# EAGLE design M900proto (EAGLE 6.6.0)
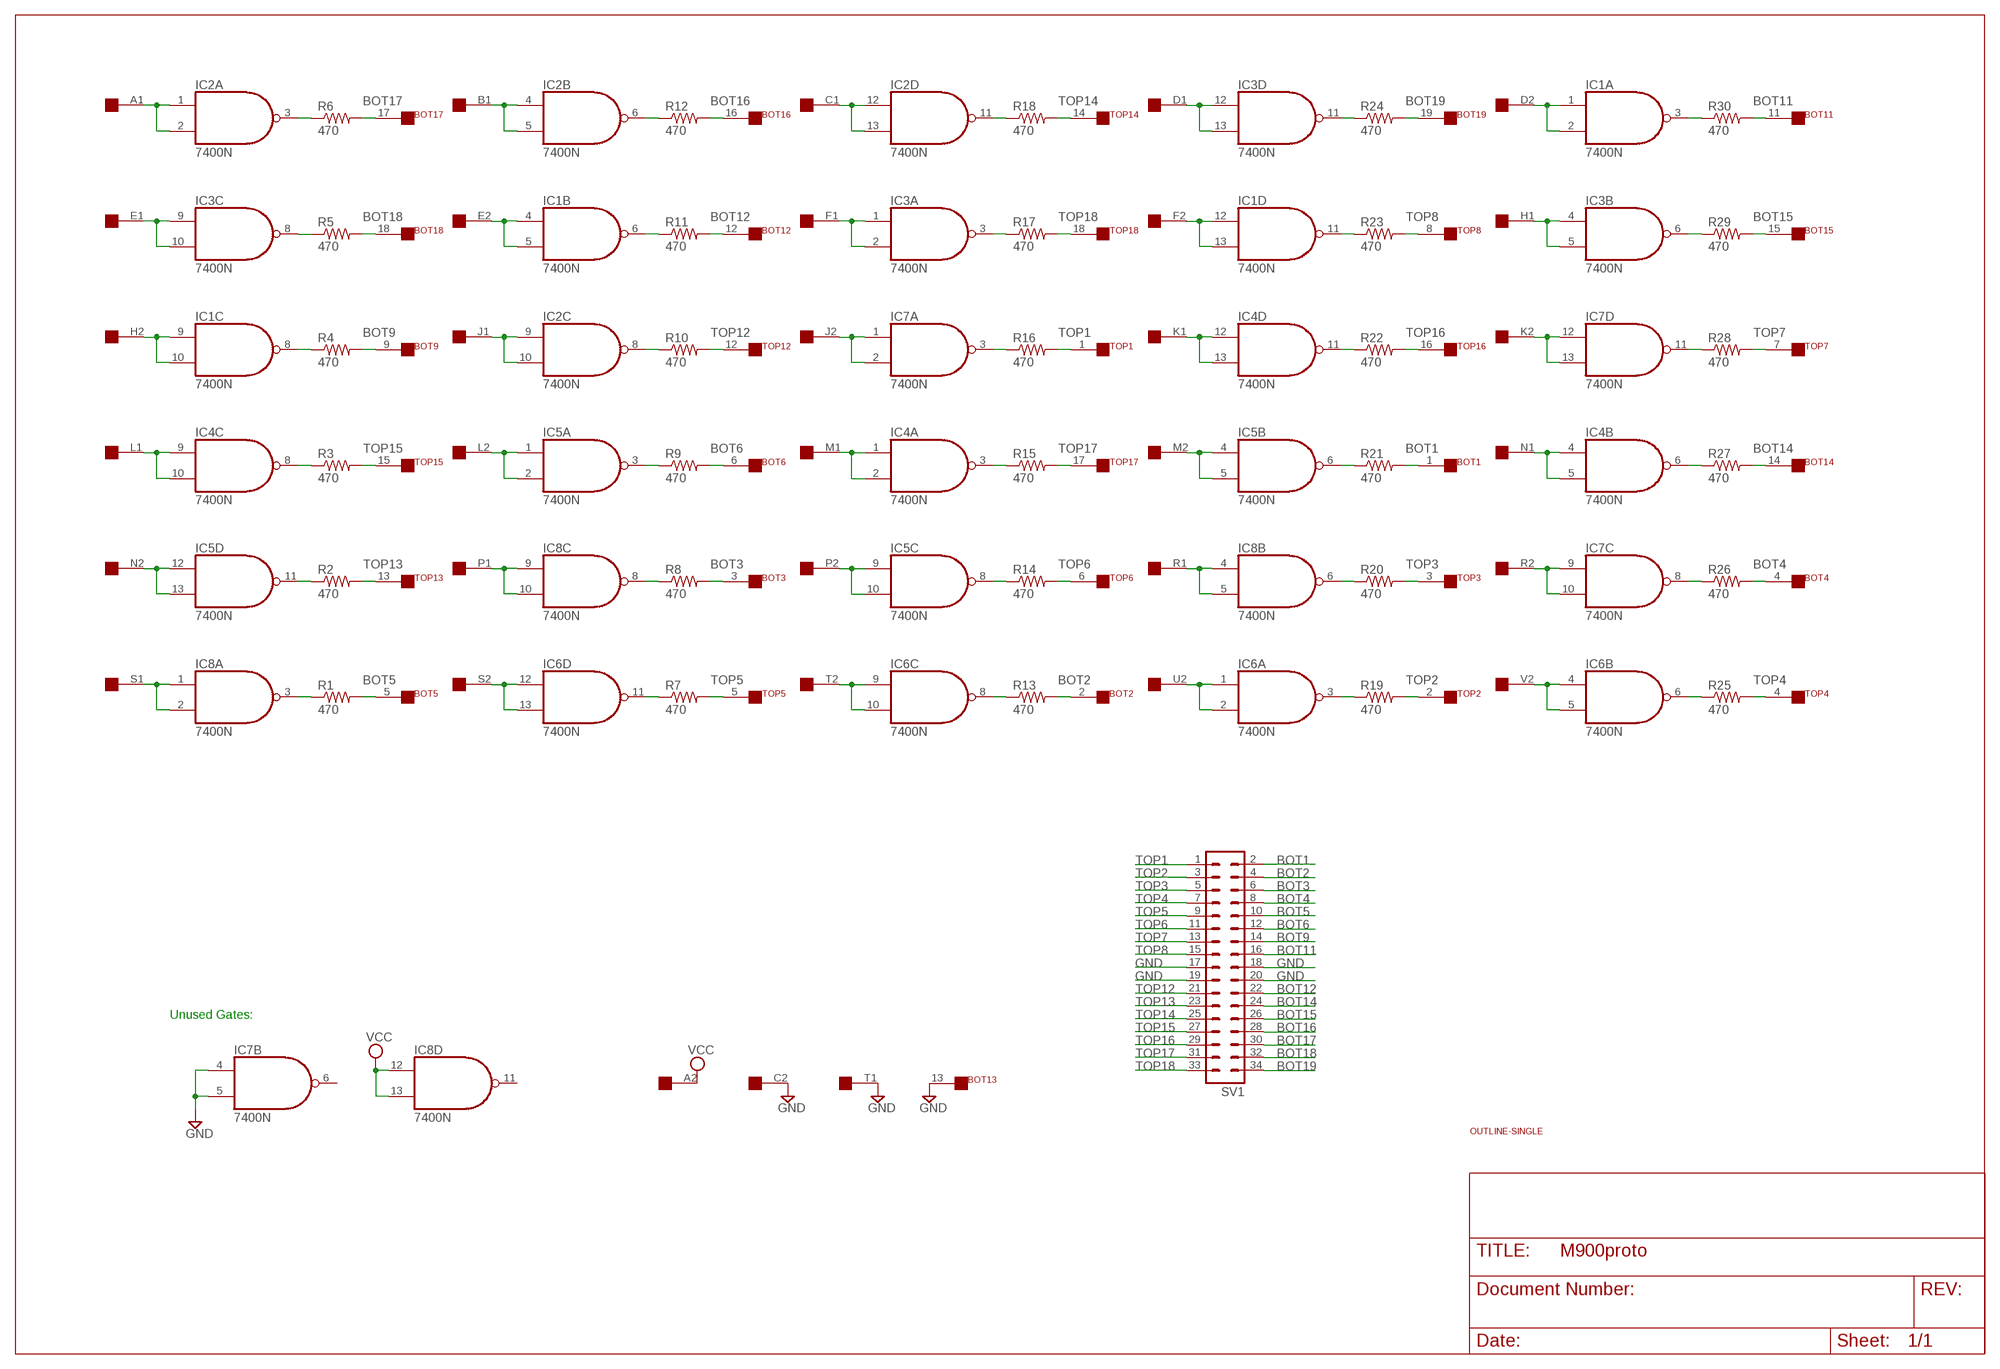
[diagram p0: schematic, sheet 1]

## Parts
BOT  FLEX19  [FLEX19]
EDGE  SINGLE  [EDGE-CON2]
IC1  7400N  [DIL14]
IC2  7400N  [DIL14]
IC3  7400N  [DIL14]
IC4  7400N  [DIL14]
IC5  7400N  [DIL14]
IC6  7400N  [DIL14]
IC7  7400N  [DIL14]
IC8  7400N  [DIL14]
R1  470  R-US_0207/10  [0207/10]
R2  470  R-US_0207/10  [0207/10]
R3  470  R-US_0207/10  [0207/10]
R4  470  R-US_0207/10  [0207/10]
R5  470  R-US_0207/10  [0207/10]
R6  470  R-US_0207/10  [0207/10]
R7  470  R-US_0207/10  [0207/10]
R8  470  R-US_0207/10  [0207/10]
R9  470  R-US_0207/10  [0207/10]
R10  470  R-US_0207/10  [0207/10]
R11  470  R-US_0207/10  [0207/10]
R12  470  R-US_0207/10  [0207/10]
R13  470  R-US_0207/10  [0207/10]
R14  470  R-US_0207/10  [0207/10]
R15  470  R-US_0207/10  [0207/10]
R16  470  R-US_0207/10  [0207/10]
R17  470  R-US_0207/10  [0207/10]
R18  470  R-US_0207/10  [0207/10]
R19  470  R-US_0207/10  [0207/10]
R20  470  R-US_0207/10  [0207/10]
R21  470  R-US_0207/10  [0207/10]
R22  470  R-US_0207/10  [0207/10]
R23  470  R-US_0207/10  [0207/10]
R24  470  R-US_0207/10  [0207/10]
R25  470  R-US_0207/10  [0207/10]
R26  470  R-US_0207/10  [0207/10]
R27  470  R-US_0207/10  [0207/10]
R28  470  R-US_0207/10  [0207/10]
R29  470  R-US_0207/10  [0207/10]
R30  470  R-US_0207/10  [0207/10]
SV1  MA17-2  [MA17-2]
TOP  FLEX19  [FLEX19]
U$2  OUTLINE-SINGLE  [SINGLE]

## Nets
BOT1: BOT.1 R21.2 SV1.2
BOT2: BOT.2 R13.2 SV1.4
BOT3: BOT.3 R8.2 SV1.6
BOT4: BOT.4 R26.2 SV1.8
BOT5: BOT.5 R1.2 SV1.10
BOT6: BOT.6 R9.2 SV1.12
BOT9: BOT.9 R4.2 SV1.14
BOT11: BOT.11 R30.2 SV1.16
BOT12: BOT.12 R11.2 SV1.22
BOT14: BOT.14 R27.2 SV1.24
BOT15: BOT.15 R29.2 SV1.26
BOT16: BOT.16 R12.2 SV1.28
BOT17: BOT.17 R6.2 SV1.30
BOT18: BOT.18 R5.2 SV1.32
BOT19: BOT.19 R24.2 SV1.34
GND [supply]: BOT.13 EDGE.C2 EDGE.T1 IC7.4(B:I0) IC7.5(B:I1) SV1.17 SV1.18 SV1.19 SV1.20
N$1: EDGE.A1 IC2.1(A:I0) IC2.2(A:I1)
N$2: IC2.3(A:O) R6.1
N$3: IC3.8(C:O) R5.1
N$4: IC1.8(C:O) R4.1
N$5: IC4.8(C:O) R3.1
N$6: IC5.11(D:O) R2.1
N$7: EDGE.H2 IC1.9(C:I0) IC1.10(C:I1)
N$8: EDGE.S1 IC8.1(A:I0) IC8.2(A:I1)
N$9: EDGE.N2 IC5.12(D:I0) IC5.13(D:I1)
N$10: EDGE.L1 IC4.9(C:I0) IC4.10(C:I1)
N$11: EDGE.E1 IC3.9(C:I0) IC3.10(C:I1)
N$12: EDGE.P1 IC8.9(C:I0) IC8.10(C:I1)
N$13: EDGE.B1 IC2.4(B:I0) IC2.5(B:I1)
N$14: EDGE.E2 IC1.4(B:I0) IC1.5(B:I1)
N$15: EDGE.J1 IC2.9(C:I0) IC2.10(C:I1)
N$16: EDGE.L2 IC5.1(A:I0) IC5.2(A:I1)
N$17: EDGE.S2 IC6.12(D:I0) IC6.13(D:I1)
N$18: IC8.8(C:O) R8.1
N$19: IC5.3(A:O) R9.1
N$20: IC2.8(C:O) R10.1
N$21: IC1.6(B:O) R11.1
N$22: IC2.6(B:O) R12.1
N$23: IC6.11(D:O) R7.1
N$24: IC8.3(A:O) R1.1
N$25: EDGE.P2 IC5.9(C:I0) IC5.10(C:I1)
N$26: EDGE.C1 IC2.12(D:I0) IC2.13(D:I1)
N$27: EDGE.F1 IC3.1(A:I0) IC3.2(A:I1)
N$28: EDGE.J2 IC7.1(A:I0) IC7.2(A:I1)
N$29: EDGE.M1 IC4.1(A:I0) IC4.2(A:I1)
N$30: EDGE.T2 IC6.9(C:I0) IC6.10(C:I1)
N$31: IC6.8(C:O) R13.1
N$32: IC5.8(C:O) R14.1
N$33: IC4.3(A:O) R15.1
N$34: IC7.3(A:O) R16.1
N$35: IC2.11(D:O) R18.1
N$36: IC3.3(A:O) R17.1
N$37: IC6.3(A:O) R19.1
N$38: IC8.6(B:O) R20.1
N$39: IC5.6(B:O) R21.1
N$40: IC4.11(D:O) R22.1
N$41: IC1.11(D:O) R23.1
N$42: IC3.11(D:O) R24.1
N$43: EDGE.R1 IC8.4(B:I0) IC8.5(B:I1)
N$44: EDGE.F2 IC1.12(D:I0) IC1.13(D:I1)
N$45: EDGE.K1 IC4.12(D:I0) IC4.13(D:I1)
N$46: EDGE.M2 IC5.4(B:I0) IC5.5(B:I1)
N$47: EDGE.U2 IC6.1(A:I0) IC6.2(A:I1)
N$48: EDGE.R2 IC7.9(C:I0) IC7.10(C:I1)
N$49: EDGE.D1 IC3.12(D:I0) IC3.13(D:I1)
N$50: EDGE.D2 IC1.1(A:I0) IC1.2(A:I1)
N$51: EDGE.H1 IC3.4(B:I0) IC3.5(B:I1)
N$52: EDGE.K2 IC7.12(D:I0) IC7.13(D:I1)
N$53: EDGE.N1 IC4.4(B:I0) IC4.5(B:I1)
N$54: EDGE.V2 IC6.4(B:I0) IC6.5(B:I1)
N$55: IC6.6(B:O) R25.1
N$56: IC7.8(C:O) R26.1
N$57: IC4.6(B:O) R27.1
N$58: IC7.11(D:O) R28.1
N$59: IC3.6(B:O) R29.1
N$60: IC1.3(A:O) R30.1
TOP1: R16.2 SV1.1 TOP.1
TOP2: R19.2 SV1.3 TOP.2
TOP3: R20.2 SV1.5 TOP.3
TOP4: R25.2 SV1.7 TOP.4
TOP5: R7.2 SV1.9 TOP.5
TOP6: R14.2 SV1.11 TOP.6
TOP7: R28.2 SV1.13 TOP.7
TOP8: R23.2 SV1.15 TOP.8
TOP12: R10.2 SV1.21 TOP.12
TOP13: R2.2 SV1.23 TOP.13
TOP14: R18.2 SV1.25 TOP.14
TOP15: R3.2 SV1.27 TOP.15
TOP16: R22.2 SV1.29 TOP.16
TOP17: R15.2 SV1.31 TOP.17
TOP18: R17.2 SV1.33 TOP.18
VCC [supply]: EDGE.A2 IC8.12(D:I0) IC8.13(D:I1)
Unconnected: BOT.7 BOT.8 BOT.10 EDGE.B2 EDGE.U1 EDGE.V1 IC7.6(B:O) IC8.11(D:O) TOP.9 TOP.10 TOP.11 TOP.19

## Notes on the sheet
- Unused Gates:

## Power pins joined to a net without a drawn wire
GND: IC1.7(P:GND) IC2.7(P:GND) IC3.7(P:GND) IC4.7(P:GND) IC5.7(P:GND) IC6.7(P:GND) IC7.7(P:GND) IC8.7(P:GND)
VCC: IC1.14(P:VCC) IC2.14(P:VCC) IC3.14(P:VCC) IC4.14(P:VCC) IC5.14(P:VCC) IC6.14(P:VCC) IC7.14(P:VCC) IC8.14(P:VCC)

## Library data of the parts
BOT TOP = dec-con:FLEX19: 19 pin Flexprint Connection
EDGE = dec-con:SINGLE: Single-Height DEC board
IC1-IC8 = 74xx-us:74*00: Quad 2-input NAND gate
R1-R30 = rcl:R-US_: RESISTOR, American symbol
SV1 = con-lstb:MA17-2: PIN HEADER; OC_FARNELL: unknown; OC_NEWARK: unknown
U$2 = dec-con:OUTLINE-*: Board outlines for DEC boards.

## Net classes
0 default: width 0.381 mm
1 supply: width 0.762 mm

## Board
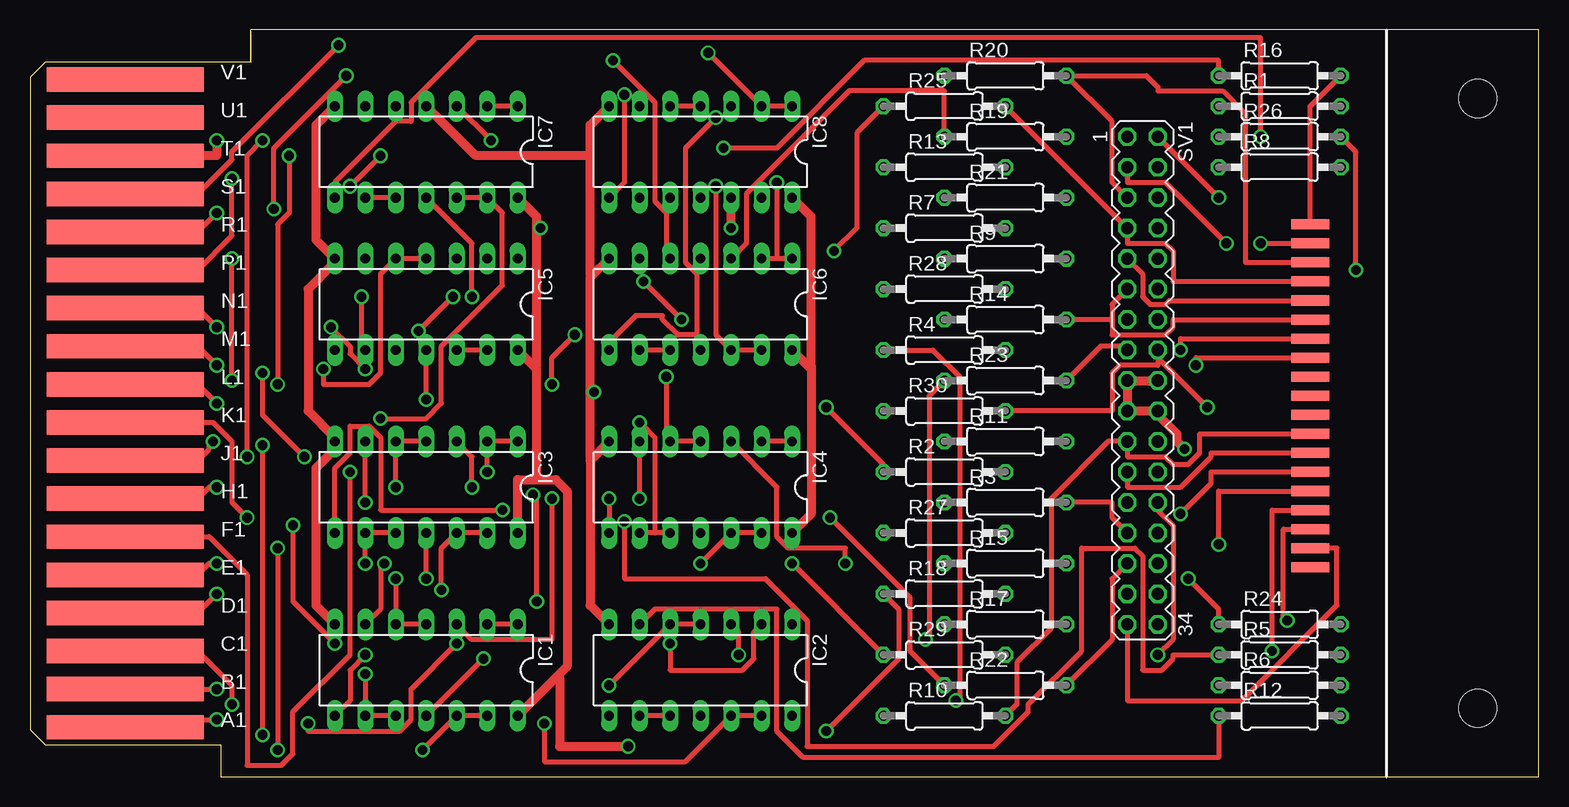
[diagram p1: board, top side]
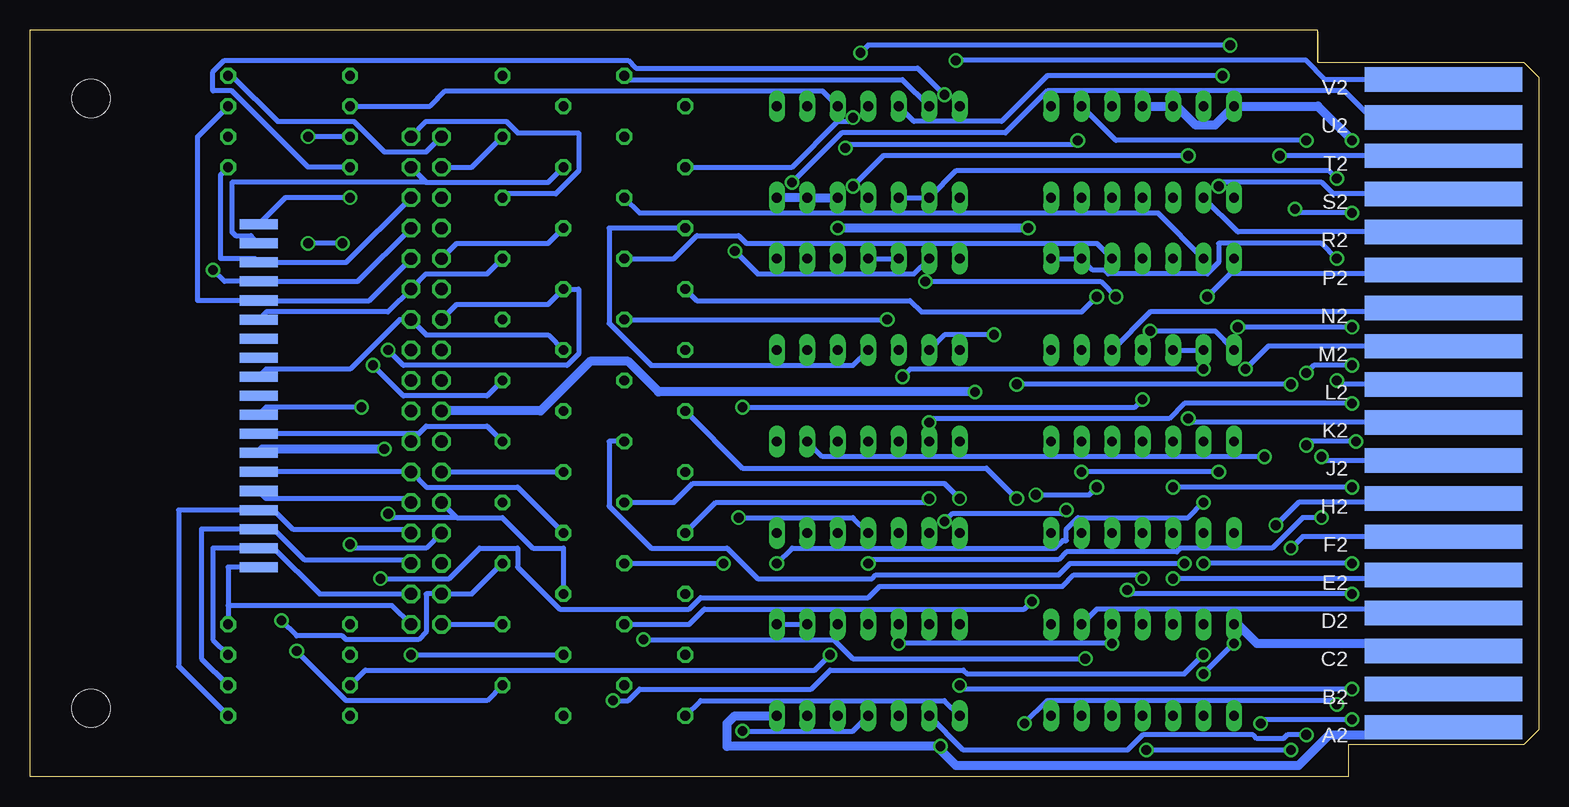
[diagram p2: board, bottom side, seen from below]

Size 125.73 x 62.23 mm. Coordinates in mm from the lower left corner, seen from the top.
Copper layers (1+16): Top 0.035mm / dielectric 1.5mm / Bottom 0.035mm
Design rules "16mils": minimum track width 16mil, minimum drill 32mil, track to track 15mil, track to pad 10mil, pad to pad 10mil, via to via 10mil, smd to smd 10mil, copper to edge 13mil, drill to drill 10mil, minimum pad ring 10mil, minimum via ring 8mil, stop-mask expansion 0mil, vias tented up to drill 0mil, thermal gap 10mil

### Footprints (pad centres in the part's own frame; a part is rotated, then mirrored left to right if it is on the bottom)
FLEX19 = smd 3.175 x 0.838: 1 0,14.287; 2 0,12.7; 3 0,11.113; 4 0,9.525; 5 0,7.938; 6 0,6.35; 7 0,4.763; 8 0,3.175; 9 0,1.587; 10 0,0; 11 0,-1.587; 12 0,-3.175; 13 0,-4.763; 14 0,-6.35; 15 0,-7.938; 16 0,-9.525; 17 0,-11.113; 18 0,-12.7; 19 0,-14.287
EDGE-CON2 = smd 13.106 x 2.032: A1 7.938,4.128; B1 7.938,7.303; C1 7.938,10.477; D1 7.938,13.652; E1 7.938,16.828; F1 7.938,20.003; H1 7.938,23.177; J1 7.938,26.352; K1 7.938,29.527; L1 7.938,32.703; M1 7.938,35.877; N1 7.938,39.053; P1 7.938,42.227; R1 7.938,45.403; S1 7.938,48.578; T1 7.938,51.752; U1 7.938,54.928; V1 7.938,58.102 | smd 13.106 x 2.032 bottom: A2 7.938,4.128; B2 7.938,7.303; C2 7.938,10.477; D2 7.938,13.652; E2 7.938,16.828; F2 7.938,20.003; H2 7.938,23.177; J2 7.938,26.352; K2 7.938,29.527; L2 7.938,32.703; M2 7.938,35.877; N2 7.938,39.053; P2 7.938,42.227; R2 7.938,45.403; S2 7.938,48.578; T2 7.938,51.752; U2 7.938,54.928; V2 7.938,58.102
DIL14 = drill 0.813 long: 1 -7.62,-3.81; 2 -5.08,-3.81; 3 -2.54,-3.81; 4 0,-3.81; 5 2.54,-3.81; 6 5.08,-3.81; 7 7.62,-3.81; 8 7.62,3.81; 9 5.08,3.81; 10 2.54,3.81; 11 0,3.81; 12 -2.54,3.81; 13 -5.08,3.81; 14 -7.62,3.81
0207/10 = drill 0.813 octagon: 1 -5.08,0; 2 5.08,0
MA17-2 = drill 1.016 octagon: 1 -20.32,-1.27; 2 -20.32,1.27; 3 -17.78,-1.27; 4 -17.78,1.27; 5 -15.24,-1.27; 6 -15.24,1.27; 7 -12.7,-1.27; 8 -12.7,1.27; 9 -10.16,-1.27; 10 -10.16,1.27; 11 -7.62,-1.27; 12 -7.62,1.27; 13 -5.08,-1.27; 14 -5.08,1.27; 15 -2.54,-1.27; 16 -2.54,1.27; 17 0,-1.27; 18 0,1.27; 19 2.54,-1.27; 20 2.54,1.27; 21 5.08,-1.27; 22 5.08,1.27; 23 7.62,-1.27; 24 7.62,1.27; 25 10.16,-1.27; 26 10.16,1.27; 27 12.7,-1.27; 28 12.7,1.27; 29 15.24,-1.27; 30 15.24,1.27; 31 17.78,-1.27; 32 17.78,1.27; 33 20.32,-1.27; 34 20.32,1.27
SINGLE = hole 3.175: 120.65,56.515; 120.65,5.715

### Placement (x,y rotation side)
BOT  106.68,31.75 0 bottom
EDGE  0,0 0 top
IC1  33.02,8.89 180 top
IC2  55.88,8.89 180 top
IC3  33.02,24.13 180 top
IC4  55.88,24.13 180 top
IC5  33.02,39.37 180 top
IC6  55.88,39.37 180 top
IC7  33.02,52.07 180 top
IC8  55.88,52.07 180 top
R1  104.14,55.88 0 top
R2  76.2,25.4 0 top
R3  81.28,22.86 0 top
R4  76.2,35.56 0 top
R5  104.14,10.16 0 top
R6  104.14,7.62 0 top
R7  76.2,45.72 0 top
R8  104.14,50.8 0 top
R9  81.28,43.18 0 top
R10  76.2,5.08 0 top
R11  81.28,27.94 0 top
R12  104.14,5.08 0 top
R13  76.2,50.8 0 top
R14  81.28,38.1 0 top
R15  81.28,17.78 0 top
R16  104.14,58.42 0 top
R17  81.28,12.7 0 top
R18  76.2,15.24 0 top
R19  81.28,53.34 0 top
R20  81.28,58.42 0 top
R21  81.28,48.26 0 top
R22  81.28,7.62 0 top
R23  81.28,33.02 0 top
R24  104.14,12.7 0 top
R25  76.2,55.88 0 top
R26  104.14,53.34 0 top
R27  76.2,20.32 0 top
R28  76.2,40.64 0 top
R29  76.2,10.16 0 top
R30  76.2,30.48 0 top
SV1  92.71,33.02 270 top
TOP  106.68,31.75 0 top
U$2  0,0 0 top

### Tracks (layer width: path | path; a pad name or v marks a point on that pad's centre or on a via)
BOT1  (via drill 0.81)
  Top 0.406: SV1.2 v99.06,48.26
  Bottom 0.406: R21.2 86.04,48.58 81.92,48.58 80.01,50.48 80.01,53.66 85.09,53.66 86.04,54.61 92.71,54.61 SV1.2 | BOT.1 104.46,48.26 v99.06,48.26
BOT2
  Bottom 0.406: R13.2 82.55,49.53 92.71,49.53 | SV1.4 92.71,49.53 | BOT.2 107.32,45.09 108.59,45.09 108.9,45.4 108.9,49.53 92.71,49.53
BOT3
  Bottom 0.406: R8.2 109.86,50.16 109.86,43.18 107,43.18 BOT.3 99.38,42.86 SV1.6
BOT4  (via drill 0.81)
  Top 0.406: R26.2 110.49,52.07 v110.49,42.23
  Bottom 0.406: v110.49,42.23 109.54,41.27 BOT.4 98.43,41.27 SV1.8
BOT5
  Bottom 0.406: R1.2 111.76,53.34 111.76,39.69 BOT.5 97.47,39.69 SV1.10
BOT6
  Bottom 0.406: R9.2 87.63,41.91 92.71,41.91 SV1.12 95.89,38.73 106.05,38.73 BOT.6
BOT9
  Bottom 0.406: R4.2 82.55,36.83 92.71,36.83 SV1.14 94.93,38.1 99.06,33.97 106.05,33.97 BOT.9
BOT11  (via drill 0.81)
  Top 0.406: R30.2 90.17,30.48 90.17,33.66 90.81,34.29 93.98,34.29 93.98,34.92 | 93.98,34.92 SV1.16 93.98,34.92 | 93.98,34.92 v98.11,30.8
  Bottom 0.406: BOT.11 106.05,30.8 v98.11,30.8
BOT12
  Bottom 0.406: R11.2 87.63,29.21 92.71,29.21 93.35,28.57 | SV1.22 93.35,28.57 | 93.35,28.57 BOT.12
BOT14
  Bottom 0.406: R27.2 85.09,24.13 92.71,24.13 SV1.24 BOT.14
BOT15  (via drill 0.81)
  Top 0.406: v93.98,10.16 95.25,11.43 95.25,20.95 93.98,22.23 SV1.26
  Bottom 0.406: v93.98,10.16 R29.2 | BOT.15 106.05,23.18 94.3,23.18 SV1.26
BOT16
  Bottom 0.406: R12.2 113.35,9.21 113.35,22.23 BOT.16 105.41,22.23 103.82,20.64 94.3,20.64 SV1.28
BOT17
  Bottom 0.406: R6.2 111.44,9.84 111.44,20.64 BOT.17 105.41,20.64 102.87,18.1 94.3,18.1 SV1.30
BOT18
  Bottom 0.406: R5.2 110.49,11.43 110.49,19.05 BOT.18 105.41,19.05 101.6,15.24 SV1.32
BOT19
  Bottom 0.406: 109.22,14.29 109.22,17.46 BOT.19 | 109.22,14.29 R24.2 | SV1.34 95.57,14.29 109.22,14.29
GND  (via drill 0.81)
  Top 0.762: IC1.7 23.81,14.29 23.81,25.72 25.4,27.3 IC3.7 25.4,28.26 23.18,30.48 23.18,40.64 25.4,42.86 IC5.7 23.81,44.77 23.81,54.29 IC7.7 | EDGE.T1 15.56,51.75 v15.56,53.02 | SV1.18 91.76,33.02 SV1.17 SV1.19 91.76,30.48 SV1.20 93.98,30.16 95.57,28.57 95.57,27.94 v96.2,27.3 | IC2.7 46.67,14.29 46.67,26.35 | IC4.7 46.67,26.35 | 46.83,41.75 46.67,41.59 46.67,32.07 | 46.83,41.75 IC6.7 | 46.67,32.07 46.67,26.67 46.67,26.35 | IC8.7 46.67,54.29 46.67,51.75 | 46.67,51.75 46.67,41.91 46.83,41.75 | v46.99,32.07 46.67,32.07 | IC7.4 37.15,51.75 46.36,51.75 46.67,51.75
  Bottom 0.762: IC7.4 IC7.5 30.16,55.88 28.58,54.29 26.99,54.29 IC7.7 25.08,55.88 18.42,55.88 v15.56,53.02 | EDGE.C2 8.57,11.11 23.5,11.11 25.08,12.7 IC1.7 | BOT.13 106.36,27.3 v96.2,27.3 | SV1.19 83.19,30.48 79.06,34.61 75.88,34.61 73.34,32.07 v46.99,32.07
N$1  (via drill 0.81)
  Top 0.406: IC2.2 60.33,12.06 60.33,9.84 59.37,8.89 53.34,8.89 v53.34,11.11 | v35.56,11.11 31.75,7.3 31.75,4.76 30.8,3.81 23.18,3.81 v23.18,4.45 | v15.56,4.76 7.94,4.76 EDGE.A1
  Bottom 0.406: IC2.1 IC2.2 | v35.56,11.11 v53.34,11.11 | v23.18,4.45 22.86,4.76 v15.56,4.76
N$2  (via drill 0.81)
  Top 0.406: IC2.3 59.06,12.06 v59.06,10.16
  Bottom 0.406: v59.06,10.16 60.33,8.89 97.79,8.89 R6.1
N$3  (via drill 0.81)
  Top 0.406: R5.1 95.25,10.16 95.25,9.84 94.3,8.89 92.71,8.89 92.71,18.41 92.08,19.05 87.63,19.05 87.63,10.48 83.19,6.03 83.19,5.4 80.33,2.54 64.77,2.54 64.77,13.02 61.28,16.51 49.53,16.51 v49.53,21.27 | v39.37,22.23 29.21,22.23 29.21,28.26 28.26,29.21 26.67,29.21 26.67,26.99 25.4,25.72 IC3.8
  Bottom 0.406: v49.53,21.27 48.9,21.91 39.69,21.91 v39.37,22.23
N$4  (via drill 0.81)
  Top 0.406: IC1.8 26.67,6.35 26.67,8.89 v27.94,10.16 | v77.15,6.35 77.47,6.67 77.47,33.34 75.25,35.56 R4.1
  Bottom 0.406: v27.94,10.16 29.53,8.57 47.63,8.57 47.94,8.89 59.06,8.89 60.64,7.3 74.93,7.3 75.88,6.35 v77.15,6.35
N$5  (via drill 0.81)
  Top 0.406: v48.26,23.18 IC4.8
  Bottom 0.406: v48.26,23.18 49.53,24.45 70.49,24.45 72.07,22.86 R3.1
N$6  (via drill 0.81)
  Top 0.406: v33.02,31.43 IC5.11 | v66.36,30.8 71.12,26.04 R2.1
  Bottom 0.406: v33.02,31.43 33.66,30.8 v66.36,30.8
N$7  (via drill 0.81)
  Top 0.406: IC1.10 IC1.9 v27.94,8.57 | v25.4,11.11 21.91,14.61 v21.91,20.95
  Bottom 0.406: v25.4,11.11 v27.94,8.57 | v21.91,20.95 20,22.86 8.26,22.86 EDGE.H2
N$8  (via drill 0.81)
  Top 0.406: IC8.1 IC8.2 v56.52,60.33 | v25.72,60.96 16.83,52.07 16.83,51.44 13.97,48.58 EDGE.S1
  Bottom 0.406: v56.52,60.33 55.88,60.96 v25.72,60.96
N$9
  Top 0.406: IC5.13 IC5.12
  Bottom 0.406: IC5.12 32.39,38.73 8.26,38.73 EDGE.N2
N$10  (via drill 0.81)
  Top 0.406: IC4.10 52.07,20.32 | 52.07,20.32 IC4.9 | 52.07,20.32 52.07,28.26 v50.8,29.53 | v15.56,31.11 13.97,32.7 EDGE.L1
  Bottom 0.406: v50.8,29.53 50.48,29.84 30.8,29.84 29.53,31.11 v15.56,31.11
N$11  (via drill 0.81)
  Top 0.406: IC3.10 IC3.9 v27.94,17.78 | v15.56,17.78 14.92,17.78 13.97,16.83 EDGE.E1
  Bottom 0.406: v15.56,17.78 v27.94,17.78
N$12  (via drill 0.81)
  Top 0.406: v16.83,49.85 16.83,45.09 13.97,42.23 EDGE.P1
  Bottom 0.406: IC8.10 IC8.9 48.58,50.48 17.46,50.48 v16.83,49.85
N$13  (via drill 0.81)
  Top 0.406: IC2.4 IC2.5 v48.26,7.62 | EDGE.B1 v15.56,7.3
  Bottom 0.406: v48.26,7.62 47.94,7.3 v15.56,7.3
N$14  (via drill 0.81)
  Top 0.406: IC1.4 IC1.5 v30.48,16.51
  Bottom 0.406: v30.48,16.51 8.26,16.51 EDGE.E2
N$15  (via drill 0.81)
  Top 0.406: IC2.10 IC2.9 | v19.37,27.62 v19.37,3.49 | v15.24,27.94 14.92,27.62 14.92,27.3 13.97,26.35 EDGE.J1
  Bottom 0.406: IC2.9 47.94,2.22 34.29,2.22 33.02,3.49 23.81,3.49 23.5,3.17 21.27,3.17 20.96,3.49 v19.37,3.49 | v19.37,27.62 19.05,27.94 v15.24,27.94
N$16  (via drill 0.81)
  Top 0.406: v16.83,33.02 v16.83,43.18
  Bottom 0.406: IC5.1 IC5.2 37.15,42.23 36.2,42.23 35.88,41.91 27.62,41.91 26.67,42.86 26.67,44.45 18.1,44.45 v16.83,43.18 | v16.83,33.02 16.51,32.7 EDGE.L2
N$17  (via drill 0.81)
  Top 0.406: IC6.13 IC6.12 57.15,36.83 v57.15,49.21 | v26.67,49.21 v29.21,51.75
  Bottom 0.406: v57.15,49.21 54.61,51.75 v29.21,51.75 | v26.67,49.21 26.35,49.53 18.1,49.53 17.15,48.58 EDGE.S2
N$18  (via drill 0.81)
  Top 0.406: IC8.8 49.53,49.53 v49.53,56.83
  Bottom 0.406: v49.53,56.83 51.75,59.05 75.25,59.05 75.88,59.69 109.54,59.69 110.49,58.74 110.49,57.15 108.9,57.15 102.55,50.8 R8.1
N$19
  Bottom 0.406: IC5.3 36.83,44.45 66.04,44.45 66.68,45.09 70.17,45.09 72.07,43.18 R9.1
N$20
  Bottom 0.406: IC2.8 49.53,6.35 69.85,6.35 R10.1
N$21  (via drill 0.81)
  Top 0.406: IC1.6 29.21,13.97 29.21,17.46 v29.53,17.78
  Bottom 0.406: v29.53,17.78 39.05,17.78 40.01,16.83 55.25,16.83 55.56,16.51 65.09,16.51 67.63,19.05 73.98,19.05 77.47,22.54 77.47,27.94 R11.1
N$22
  Top 0.406: IC2.6 52.07,13.97 62.23,13.97 62.23,3.81 64.45,1.59 99.06,1.59 R12.1
N$23
  Bottom 0.406: IC6.11 57.15,34.29 73.98,34.29 77.47,37.78 77.47,45.72 R7.1
N$24
  Bottom 0.406: IC8.3 59.69,57.15 91.12,57.15 92.39,55.88 R1.1
N$25  (via drill 0.81)
  Top 0.406: IC5.9 27.62,35.88 v27.62,40.01
  Bottom 0.406: IC5.10 IC5.9 | v27.62,40.01 25.72,41.91 8.26,41.91 EDGE.P2
N$26  (via drill 0.81)
  Top 0.406: IC2.13 IC2.12 54.61,1.27 42.86,1.27 v42.86,4.45 | v16.83,6.03 16.83,7.62 13.97,10.48 EDGE.C1
  Bottom 0.406: v42.86,4.45 40.96,6.35 17.15,6.35 v16.83,6.03
N$27  (via drill 0.81)
  Top 0.406: IC3.1 IC3.2 v38.1,25.4 | v26.67,25.4 26.67,10.16 21.91,5.4 21.91,1.91 20.96,0.95 18.1,0.95 18.1,16.83 14.92,20 EDGE.F1
  Bottom 0.406: v26.67,25.4 v38.1,25.4
N$28  (via drill 0.81)
  Top 0.406: IC7.1 IC7.2 | v19.37,53.02 18.1,51.75 v18.1,26.67
  Bottom 0.406: IC7.2 35.24,53.02 v19.37,53.02 | v18.1,26.67 17.78,26.35 EDGE.J2
N$29  (via drill 0.81)
  Top 0.406: IC4.1 IC4.2 | v22.86,26.67 19.37,30.16 v19.37,33.66 | v15.56,34.29 13.97,35.88 EDGE.M1
  Bottom 0.406: IC4.2 59.69,26.67 v22.86,26.67 | v19.37,33.66 18.73,34.29 v15.56,34.29
N$30  (via drill 0.81)
  Top 0.406: IC6.10 IC6.9 | v45.4,36.83 43.5,34.92 v43.5,32.7 | v20.64,32.7 20.64,46.04 21.59,46.99 v21.59,51.75
  Bottom 0.406: IC6.9 49.53,36.83 v45.4,36.83 | v20.64,32.7 v43.5,32.7 | EDGE.T2 v21.59,51.75
N$31  (via drill 0.81)
  Top 0.406: IC6.8 48.58,35.88 48.58,36.51 50.48,38.42 52.71,38.42 52.71,38.1 53.98,36.83 55.56,36.83 55.56,41.91 54.61,42.86 54.61,52.39 v57.15,54.93
  Bottom 0.406: v57.15,54.93 57.47,54.61 58.42,54.61 62.23,50.8 R13.1
N$32  (via drill 0.81)
  Top 0.406: v35.24,40.01 v32.39,37.15 | v54.29,38.1 v51.12,41.27
  Bottom 0.406: IC5.8 26.99,37.15 v32.39,37.15 | v35.24,40.01 36.51,41.27 v51.12,41.27 | R14.1 v54.29,38.1
N$33  (via drill 0.81)
  Top 0.406: IC4.3 62.23,24.13 62.23,20 63.18,19.05 67.95,19.05 v67.95,17.78
  Bottom 0.406: R15.1 v67.95,17.78
N$34  (via drill 0.81)
  Top 0.406: v38.42,53.02 IC7.3 | v57.79,52.39 62.23,52.39 69.53,59.69 99.06,59.69 R16.1
  Bottom 0.406: v38.42,53.02 38.74,52.7 57.47,52.7 v57.79,52.39
N$35  (via drill 0.81)
  Top 0.406: v66.36,3.81 72.39,9.84 72.39,13.97 R18.1
  Bottom 0.406: IC2.11 57.15,3.81 v66.36,3.81
N$36  (via drill 0.81)
  Top 0.406: IC3.3 36.83,26.67 v36.83,24.13 | v41.91,23.5 42.23,23.18 v42.23,14.61
  Bottom 0.406: v36.83,24.13 37.47,23.5 v41.91,23.5 | v42.23,14.61 42.86,13.97 69.53,13.97 70.8,12.7 R17.1
N$37
  Top 0.406: IC6.3 59.69,44.45 59.69,48.58 68.26,57.15 76.2,57.15 R19.1
N$38
  Bottom 0.406: IC8.6 53.02,58.1 75.88,58.1 R20.1
N$39
  Bottom 0.406: IC5.6 31.75,46.99 74.93,46.99 R21.1
N$40  (via drill 0.81)
  Top 0.406: v66.68,21.59 73.34,14.92 73.34,10.48 R22.1
  Bottom 0.406: IC4.11 57.15,21.59 v66.68,21.59
N$41  (via drill 0.81)
  Top 0.406: v37.78,9.84 IC1.11 | v74.61,11.43 74.93,11.75 74.93,31.75 R23.1
  Bottom 0.406: v37.78,9.84 57.15,9.84 58.74,11.43 v74.61,11.43
N$42  (via drill 0.81)
  Top 0.406: v33.02,16.51 IC3.11 | v96.52,16.51 99.06,13.97 R24.1
  Bottom 0.406: v33.02,16.51 33.34,16.83 38.74,16.83 39.69,15.88 54.93,15.88 55.88,14.92 69.85,14.92 70.8,13.97 81.6,13.97 85.09,17.46 85.09,19.05 88.27,19.05 90.81,16.51 v96.52,16.51
N$43  (via drill 0.81)
  Top 0.406: IC8.4 IC8.5 | v26.35,58.42 20.32,52.39 v20.32,47.31 | v15.56,46.99 13.97,45.4 EDGE.R1
  Bottom 0.406: IC8.5 52.07,54.61 44.77,54.61 40.96,58.42 v26.35,58.42 | v20.32,47.31 20,46.99 v15.56,46.99
N$44  (via drill 0.81)
  Top 0.406: IC1.13 IC1.12 v32.7,2.22 | v20.64,19.05 v20.64,2.22
  Bottom 0.406: v20.64,2.22 v32.7,2.22 | v20.64,19.05 19.69,20 EDGE.F2
N$45  (via drill 0.81)
  Top 0.406: IC4.13 IC4.12 v55.88,17.78 | v18.1,21.59 16.83,22.86 16.83,27.94 15.24,29.53 EDGE.K1
  Bottom 0.406: v55.88,17.78 55.56,18.1 40.01,18.1 39.37,18.73 30.16,18.73 29.85,19.05 22.23,19.05 19.69,21.59 v18.1,21.59
N$46  (via drill 0.81)
  Top 0.406: IC5.4 IC5.5 29.21,41.91 29.21,33.66 28.26,32.7 24.45,32.7 v24.45,33.97
  Bottom 0.406: v24.45,33.97 22.54,35.88 EDGE.M2
N$47  (via drill 0.81)
  Top 0.406: IC6.1 62.23,43.18 | 62.23,43.18 IC6.2 | v62.23,49.53 62.23,43.18
  Bottom 0.406: v62.23,49.53 58.1,53.66 44.45,53.66 40.96,57.15 16.19,57.15 13.97,54.93 EDGE.U2
N$48
  Top 0.406: IC7.10 IC7.9
  Bottom 0.406: IC7.9 25.08,45.4 EDGE.R2
N$49  (via drill 0.81)
  Top 0.406: IC3.13 IC3.12 34.29,19.05 v34.29,15.56 | v15.56,15.24 13.97,13.65 EDGE.D1
  Bottom 0.406: v34.29,15.56 33.97,15.24 v15.56,15.24
N$50
  Top 0.406: IC1.1 IC1.2
  Bottom 0.406: IC1.2 36.83,13.97 8.26,13.97 EDGE.D2
N$51  (via drill 0.81)
  Top 0.406: IC3.4 IC3.5 v30.48,24.13 | v15.56,24.13 14.92,24.13 13.97,23.18 EDGE.H1
  Bottom 0.406: v15.56,24.13 v30.48,24.13
N$52  (via drill 0.81)
  Top 0.406: IC7.12 IC7.13 39.37,46.99 39.37,40.96 34.29,35.88 34.29,31.11 33.02,29.84 v29.21,29.84
  Bottom 0.406: v29.21,29.84 28.89,29.53 EDGE.K2
N$53  (via drill 0.81)
  Top 0.406: IC4.4 IC4.5 53.02,28.26 v53.02,33.34 | v27.94,33.97 26.67,35.24 26.67,35.88 v25.08,37.47 | v15.56,37.47 13.97,39.05 EDGE.N1
  Bottom 0.406: v53.02,33.34 52.39,33.97 v27.94,33.97 | v15.56,37.47 v25.08,37.47
N$54  (via drill 0.81)
  Top 0.406: IC6.5 53.02,43.5 53.02,46.99 52.07,47.94 52.07,56.2 v48.58,59.69
  Bottom 0.406: IC6.4 IC6.5 | v48.58,59.69 19.37,59.69 17.78,58.1 EDGE.V2
N$55  (via drill 0.81)
  Top 0.406: v66.99,43.81 68.9,45.72 68.9,53.66 R25.1
  Bottom 0.406: IC6.6 52.07,41.91 65.09,41.91 v66.99,43.81
N$56  (via drill 0.81)
  Top 0.406: IC7.8 25.4,49.53 30.48,54.61 31.75,54.61 31.75,56.2 37.15,61.59 102.55,61.59 v102.55,53.34
  Bottom 0.406: R26.1 v102.55,53.34
N$57  (via drill 0.81)
  Top 0.406: v50.8,23.18 IC4.6
  Bottom 0.406: v50.8,23.18 51.12,22.86 68.58,22.86 R27.1
N$58  (via drill 0.81)
  Top 0.406: IC7.11 36.83,44.45 v36.83,40.01
  Bottom 0.406: v36.83,40.01 38.1,38.73 51.44,38.73 52.39,39.69 70.17,39.69 R28.1
N$59  (via drill 0.81)
  Top 0.406: v27.94,22.86 IC3.6 | R29.1 v63.5,17.78
  Bottom 0.406: v27.94,22.86 29.21,21.59 38.42,21.59 39.37,20.64 39.37,19.68 39.69,19.68 40.32,19.05 62.23,19.05 v63.5,17.78
N$60  (via drill 0.81)
  Top 0.406: IC1.3 36.83,11.43 43.5,11.43 v43.5,23.18
  Bottom 0.406: v43.5,23.18 46.04,25.72 66.36,25.72 R30.1
TOP1
  Top 0.406: R16.2 106.68,55.88 TOP.1
  Bottom 0.406: SV1.1 92.71,52.07 96.2,52.07 98.74,54.61 105.09,54.61 108.9,58.42 R16.2
TOP2  (via drill 0.81)
  Top 0.406: v102.55,44.45 TOP.2 | v99.7,44.45 94.62,49.53 91.44,49.53 SV1.3
  Bottom 0.406: R19.2 88.9,50.8 SV1.3 | v99.7,44.45 v102.55,44.45
TOP3
  Top 0.406: SV1.5 90.17,49.53 90.17,54.61 R20.2 93.03,58.42 93.98,57.47 93.98,57.15 99.38,57.15 101.28,55.24 101.28,42.86 TOP.3
TOP4
  Top 0.406: R25.2 SV1.7 91.44,44.45 94.62,44.45 95.25,43.81 95.25,41.27 TOP.4
TOP5
  Top 0.406: TOP.5 94.93,39.69 94.62,39.37 93.35,39.37 92.71,40.01 92.71,41.91 SV1.9
  Bottom 0.406: R7.2 82.55,44.45 90.17,44.45 SV1.9
TOP6
  Top 0.406: 90.17,38.1 R14.2 | 90.17,38.1 90.17,39.37 SV1.11 | TOP.6 95.25,38.1 95.25,37.47 94.62,36.83 90.17,36.83 90.17,38.1
TOP7  (via drill 0.81)
  Top 0.406: TOP.7 95.89,36.51 v95.89,35.56
  Bottom 0.406: SV1.13 90.17,39.37 82.55,39.37 R28.2 80.01,40.64 80.01,35.24 80.96,34.29 94.62,34.29 v95.89,35.56
TOP8  (via drill 0.81)
  Top 0.406: R23.2 89.22,35.88 91.44,35.88 SV1.15 | TOP.8 97.16,34.92 v97.16,34.29
  Bottom 0.406: v97.16,34.29 94.62,31.75 87.63,31.75 R23.2
TOP12
  Top 0.406: R10.2 82.23,6.03 82.23,9.53 85.09,12.38 85.09,23.18 89.85,27.94 SV1.21 91.44,26.67 94.62,26.67 95.25,26.04 96.52,26.04 97.47,26.99 97.47,28.57 TOP.12
TOP13
  Top 0.406: TOP.13 98.43,26.99 98.43,26.67 95.89,24.13 91.44,24.13 SV1.23
  Bottom 0.406: SV1.23 R2.2
TOP14  (via drill 0.81)
  Top 0.406: TOP.14 98.43,25.4 98.43,24.45 v95.89,21.91
  Bottom 0.406: R18.2 81.28,19.05 83.82,19.05 86.36,21.59 90.17,21.59 | SV1.25 90.17,21.59 | v95.89,21.91 95.57,21.59 90.17,21.59
TOP15  (via drill 0.81)
  Top 0.406: R3.2 90.17,22.86 90.17,21.59 SV1.27 | TOP.15 99.06,23.81 v99.06,19.37
  Bottom 0.406: v99.06,19.37 98.74,19.05 92.71,19.05 SV1.27
TOP16  (via drill 0.81)
  Top 0.406: R22.2 90.17,11.43 90.17,16.51 SV1.29 | TOP.16 103.51,22.23 v103.51,10.48
  Bottom 0.406: v103.51,10.48 99.38,6.35 87.63,6.35 R22.2
TOP17  (via drill 0.81)
  Top 0.406: TOP.17 104.46,20.64 104.46,13.34 v104.78,13.02
  Bottom 0.406: R15.2 88.9,15.24 SV1.31 92.71,15.24 92.71,12.06 93.35,11.43 99.38,11.43 99.7,11.75 103.51,11.75 v104.78,13.02
TOP18
  Top 0.406: TOP.18 108.9,19.05 108.9,14.29 100.97,6.35 91.44,6.35 SV1.33
  Bottom 0.406: SV1.33 R17.2
VCC  (via drill 0.81)
  Top 0.762: IC4.14 65.09,21.91 65.09,33.97 | IC6.14 65.09,33.97 | IC8.14 65.09,46.67 65.09,34.29 65.09,33.97 | 43.97,8.41 44.77,9.21 44.77,23.81 43.82,24.77 42.23,24.77 | 43.97,8.41 IC1.14 | 42.23,24.77 40.64,24.77 IC3.14 | 42.07,34.13 42.23,33.97 42.23,25.08 42.23,24.77 | 42.07,34.13 IC5.14 | IC7.14 42.23,46.67 42.23,45.72 | 42.23,45.72 42.23,34.29 42.07,34.13 | v49.85,2.54 44.13,2.54 44.13,8.26 43.97,8.41 | v58.42,45.72 IC8.12 | v42.55,45.72 42.23,45.72
  Bottom 0.762: IC8.12 IC8.13 61.28,48.26 IC8.14 | IC2.14 66.99,5.08 67.63,4.45 67.63,2.54 v49.85,2.54 49.85,2.22 48.58,0.95 20,0.95 17.46,3.49 8.57,3.49 EDGE.A2 | v42.55,45.72 v58.42,45.72